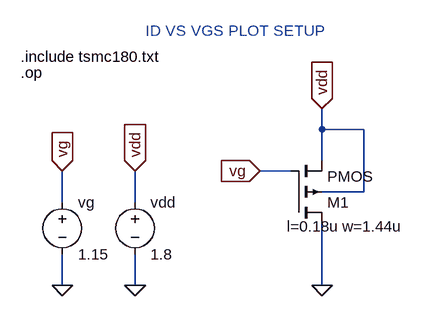
[diagram p0: schematic pmos_setup.asc]
pmos_setup.asc, the LTspice schematic file:
Version 4
SHEET 1 880 680
WIRE -272 112 -272 80
WIRE -208 112 -272 112
WIRE -272 160 -272 112
WIRE -320 176 -368 176
WIRE -208 208 -208 112
WIRE -208 208 -272 208
WIRE -672 224 -672 176
WIRE -560 224 -560 176
WIRE -672 352 -672 304
WIRE -560 352 -560 304
WIRE -272 352 -272 256
FLAG -272 352 0
FLAG -672 352 0
FLAG -672 176 vg
IOPIN -672 176 In
FLAG -560 352 0
FLAG -560 176 vdd
IOPIN -560 176 In
FLAG -272 80 vdd
IOPIN -272 80 In
FLAG -368 176 vg
IOPIN -368 176 In
SYMBOL voltage -672 208 R0
WINDOW 123 0 0 Left 0
WINDOW 39 0 0 Left 0
SYMATTR InstName vg
SYMATTR Value 1.15
SYMBOL voltage -560 208 R0
WINDOW 123 0 0 Left 0
WINDOW 39 0 0 Left 0
SYMATTR InstName vdd
SYMATTR Value 1.8
SYMBOL pmos4 -320 256 M180
WINDOW 123 -6 -5 Left 2
SYMATTR InstName M1
SYMATTR Value2 l=0.18u w=1.44u
TEXT -736 24 Left 2 !.op
TEXT -736 0 Left 2 !.include tsmc180.txt
TEXT -544 -40 Left 2 ;ID VS VGS PLOT SETUP

The netlist it stands for:
* pmos_setup.asc
vg vg 0 1.15
vdd vdd 0 1.8
M1 0 vg vdd vdd PMOS l=0.18u w=1.44u
.model NMOS NMOS
.model PMOS PMOS
.lib standard.mos
.op
.include tsmc180.txt
* ID VS VGS PLOT SETUP
.backanno
.end